# Altium schematic sheet expansion.SchDoc
size A; SheetNumber: 1; SheetTotal: 2
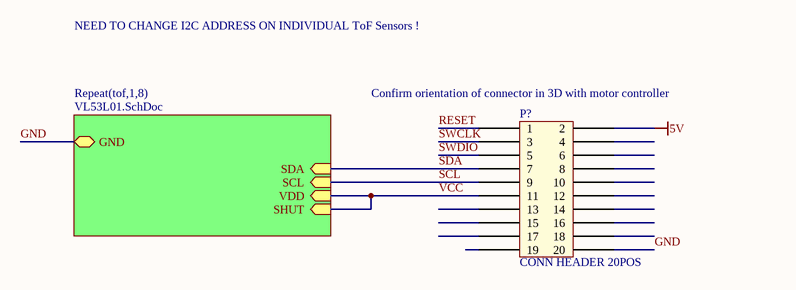
[diagram p0: expansion.SchDoc]

## Parts
P?  CONN HEADER 20POS  [DF12 20 POS]

## Sub-sheets
Repeat(tof,1,8) = VL53L01.SchDoc: GND (bidir), SCL (in), SDA (in), VDD (in), SHUT (in)

## Nets
5V: P?.2
GND: P?.20 ; sheet Repeat(tof,1,8)/GND
RESET: P?.1
SCL: P?.9 ; sheet Repeat(tof,1,8)/SCL
SDA: P?.7 ; sheet Repeat(tof,1,8)/SDA
SWCLK: P?.3
SWDIO: P?.5
VCC: P?.11 ; sheet Repeat(tof,1,8)/VDD, sheet Repeat(tof,1,8)/SHUT

Not connected (* = marked no-connect by the designer): P? 4 6 8 10 12 13 14 15 16 17 18 19

## Notes on the sheet
- NEED TO CHANGE I2C ADDRESS ON INDIVIDUAL ToF Sensors !
- (near P?) Confirm orientation of connector in 3D with motor controller

## Library data of the parts
P? = CONN HEADER 20POS: manufacturer part number: DF12D(4.0)-20DP-0.5V(81); manufacturer: Hirose Electric Co Ltd; digikey part number: H11743CT-ND; Supplier 1: Digi-Key; Supplier Part Number 1: H11743CT-ND